# Altium schematic sheet dsau-motherboard-top.SchDoc: dSAU Motherboard - Top
size Letter; Engineer: Christopher J. Woodall; Organization: Boston University EDF/ECE; DocumentNumber: 1; Revision: A; SheetNumber: 1; SheetTotal: 10; EMAIL: cwoodall@bu.edu; TeamName: Team 19; ProjectName: dSAU
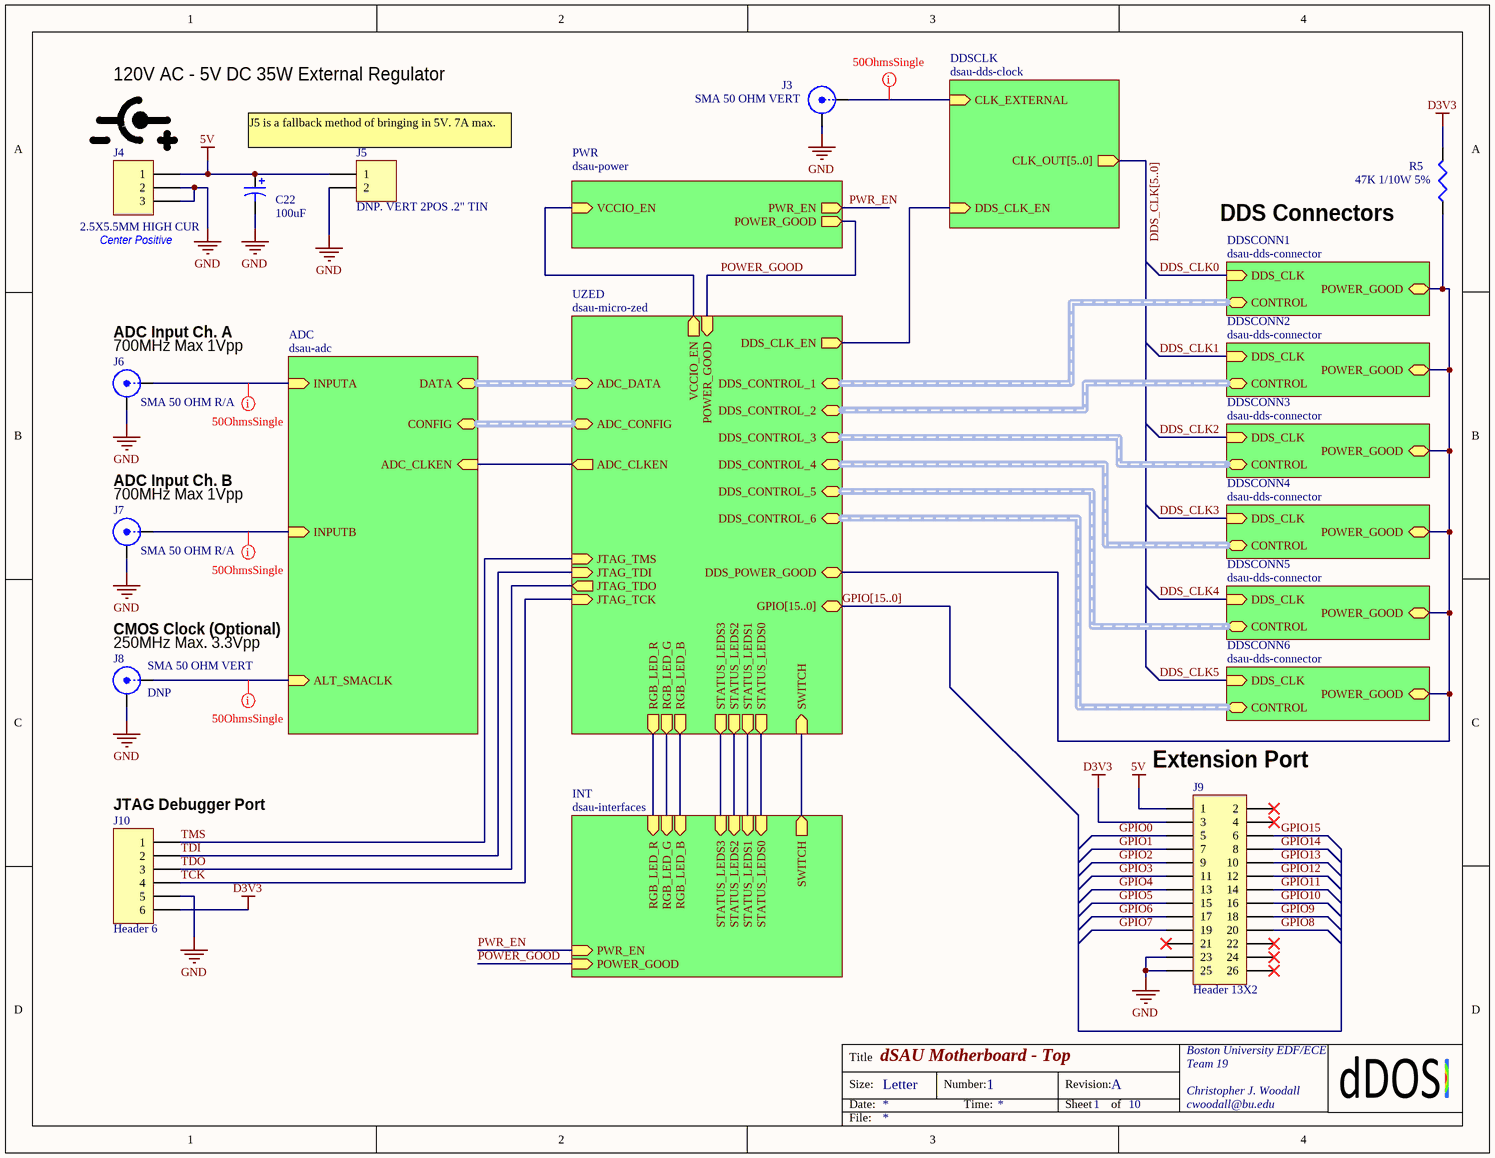
[diagram p0: dsau-motherboard-top.SchDoc]

## Parts
C22  value 100uF  [CAPPOL3216]  (hidden comment: TANT 100UF 10V 20%)
J3  SMA 50 OHM VERT  [MOLEX_SMBVERT_731000207]
J4  2.5X5.5MM HIGH CUR  [PJ-002BH]
J5  DNP. VERT 2POS .2" TIN  [MOLEX_2POS_200mil_0010085021]
J6  SMA 50 OHM R/A  [MOLEX_SMBRA_731000103]
J7  SMA 50 OHM R/A  [MOLEX_SMBRA_731000103]
J8  SMA 50 OHM VERT  value DNP  [MOLEX_SMBVERT_731000207]
J9  Header 13X2  [HDR2X13]
J10  Header 6  [HDR1X6]
R5  47K 1/10W 5%  [RESC1608L]

## Sub-sheets
ADC = dsau-adc: INPUTA (in), INPUTB (in), ALT_SMACLK (in), DATA (harness ADS62P49_LVDSDDR), ADC_CLKEN (in), CONFIG (harness ADS62P49_SPI_CONFIG)
DDSCLK = dsau-dds-clock: CLK_OUT[5..0] (out), DDS_CLK_EN (in), CLK_EXTERNAL (in)
DDSCONN1 = dsau-dds-connector: CONTROL (harness DDS_CONNECTOR), DDS_CLK (in), POWER_GOOD
DDSCONN2 = dsau-dds-connector: CONTROL (harness DDS_CONNECTOR), DDS_CLK (in), POWER_GOOD
DDSCONN3 = dsau-dds-connector: CONTROL (harness DDS_CONNECTOR), DDS_CLK (in), POWER_GOOD
DDSCONN4 = dsau-dds-connector: CONTROL (harness DDS_CONNECTOR), DDS_CLK (in), POWER_GOOD
DDSCONN5 = dsau-dds-connector: CONTROL (harness DDS_CONNECTOR), DDS_CLK (in), POWER_GOOD
DDSCONN6 = dsau-dds-connector: CONTROL (harness DDS_CONNECTOR), DDS_CLK (in), POWER_GOOD
INT = dsau-interfaces: STATUS_LEDS0 (in), STATUS_LEDS1 (in), STATUS_LEDS2 (in), STATUS_LEDS3 (in), RGB_LED_R (in), RGB_LED_G (in), RGB_LED_B (in), SWITCH (out), POWER_GOOD (in), PWR_EN (in)
PWR = dsau-power: VCCIO_EN (in), POWER_GOOD (out), PWR_EN (out)
UZED = dsau-micro-zed: ADC_DATA (harness ADS62P49_LVDSDDR), ADC_CONFIG (harness ADS62P49_SPI_CONFIG), ADC_CLKEN (out), DDS_CONTROL_1 (harness DDS_CONNECTOR), DDS_CONTROL_2 (harness DDS_CONNECTOR), DDS_CONTROL_3 (harness DDS_CONNECTOR), DDS_CONTROL_4 (harness DDS_CONNECTOR), DDS_CONTROL_5 (harness DDS_CONNECTOR), DDS_CONTROL_6 (harness DDS_CONNECTOR), JTAG_TCK (in), JTAG_TDI (in), JTAG_TDO (out), JTAG_TMS (in), STATUS_LEDS0 (out), STATUS_LEDS1 (out), STATUS_LEDS2 (out), STATUS_LEDS3 (out), RGB_LED_R (out), RGB_LED_G (out), RGB_LED_B (out), SWITCH (in), GPIO[15..0] (bidir), VCCIO_EN (out), POWER_GOOD (in), DDS_CLK_EN (out), DDS_POWER_GOOD

## Nets
5V: C22.1 J4.1 J5.1 J9.1
D3V3: J9.3 J10.6 R5.2
GND: C22.2 J3.2(Y) J4.2 J4.3 J5.2 J6.2(Y) J7.2(Y) J8.2(Y) J9.23 J9.25 J10.5
DDS_CLK0: sheet DDSCONN1/DDS_CLK
DDS_CLK1: sheet DDSCONN2/DDS_CLK
DDS_CLK2: sheet DDSCONN3/DDS_CLK
DDS_CLK3: sheet DDSCONN4/DDS_CLK
DDS_CLK4: sheet DDSCONN5/DDS_CLK
DDS_CLK5: sheet DDSCONN6/DDS_CLK
GPIO0: J9.5
GPIO1: J9.7
GPIO2: J9.9
GPIO3: J9.11
GPIO4: J9.13
GPIO5: J9.15
GPIO6: J9.17
GPIO7: J9.19
GPIO8: J9.20
GPIO9: J9.18
GPIO10: J9.16
GPIO11: J9.14
GPIO12: J9.12
GPIO13: J9.10
GPIO14: J9.8
GPIO15: J9.6
POWER_GOOD: sheet PWR/POWER_GOOD, sheet UZED/POWER_GOOD, sheet INT/POWER_GOOD
PWR_EN: sheet PWR/PWR_EN, sheet INT/PWR_EN
TCK: J10.4 ; sheet UZED/JTAG_TCK
TDI: J10.2 ; sheet UZED/JTAG_TDI
TDO: J10.3 ; sheet UZED/JTAG_TDO
TMS: J10.1 ; sheet UZED/JTAG_TMS
NetJ3_1: J3.1(X) ; sheet DDSCLK/CLK_EXTERNAL
NetJ6_1: J6.1(X) ; sheet ADC/INPUTA
NetJ7_1: J7.1(X) ; sheet ADC/INPUTB
NetJ8_1: J8.1(X) ; sheet ADC/ALT_SMACLK
NetR5_1: R5.1 ; sheet UZED/DDS_POWER_GOOD, sheet DDSCONN1/POWER_GOOD, sheet DDSCONN2/POWER_GOOD, sheet DDSCONN3/POWER_GOOD, sheet DDSCONN4/POWER_GOOD, sheet DDSCONN5/POWER_GOOD, sheet DDSCONN6/POWER_GOOD
(unnamed): sheet ADC/ADC_CLKEN, sheet UZED/ADC_CLKEN
(unnamed): sheet PWR/VCCIO_EN, sheet UZED/VCCIO_EN
(unnamed): sheet UZED/STATUS_LEDS0, sheet INT/STATUS_LEDS0
(unnamed): sheet UZED/STATUS_LEDS1, sheet INT/STATUS_LEDS1
(unnamed): sheet UZED/STATUS_LEDS2, sheet INT/STATUS_LEDS2
(unnamed): sheet UZED/STATUS_LEDS3, sheet INT/STATUS_LEDS3
(unnamed): sheet UZED/RGB_LED_R, sheet INT/RGB_LED_R
(unnamed): sheet UZED/RGB_LED_G, sheet INT/RGB_LED_G
(unnamed): sheet UZED/RGB_LED_B, sheet INT/RGB_LED_B
(unnamed): sheet UZED/SWITCH, sheet INT/SWITCH
(unnamed): sheet UZED/DDS_CLK_EN, sheet DDSCLK/DDS_CLK_EN

Not connected (* = marked no-connect by the designer): J9 2* 4* 21* 22* 24* 26*

## Buses and harness runs
bus DDS_CLK[5..0] = sheet DDSCLK/CLK_OUT[5..0]
bus GPIO[15..0] = sheet UZED/GPIO[15..0]
harness sheet ADC/CONFIG = sheet UZED/ADC_CONFIG
harness sheet ADC/DATA = sheet UZED/ADC_DATA
harness sheet DDSCONN1/CONTROL = sheet UZED/DDS_CONTROL_1
harness sheet DDSCONN2/CONTROL = sheet UZED/DDS_CONTROL_2
harness sheet DDSCONN3/CONTROL = sheet UZED/DDS_CONTROL_3
harness sheet DDSCONN4/CONTROL = sheet UZED/DDS_CONTROL_4
harness sheet DDSCONN5/CONTROL = sheet UZED/DDS_CONTROL_5
harness sheet DDSCONN6/CONTROL = sheet UZED/DDS_CONTROL_6

## Layout directives
net class 50OhmsSingle: NetJ3_1, NetJ6_1, NetJ7_1, NetJ8_1

## Notes on the sheet
- 120V AC - 5V DC 35W External Regulator
- J5 is a fallback method of bringing in 5V. 7A max.
- (near R5) DDS Connectors
- (near J4) Center Positive
- (near J6) ADC Input Ch. A
- (near J6) 700MHz Max 1Vpp
- (near J7) ADC Input Ch. B
- (near J7) 700MHz Max 1Vpp
- (near J8) CMOS Clock (Optional)
- (near J8) 250MHz Max. 3.3Vpp
- (near J9) Extension Port
- (near J10) JTAG Debugger Port
- Title
- Size:
- Date:
- Letter
- Number:
- Time:
- Revision:
- Sheet
- of
- File:

## Library data of the parts
C22 = Cap Pol3: Polarized Capacitor (Surface Mount); Manufacturer: Vishay Sprague; Manufacturer Part Number: TL8A0107M010C; Published: 8-Jun-2000; LatestRevisionDate: 29-May-2009; LatestRevisionNote: IPC-7351 Footprint Added.; PackageReference: C1206; Publisher: Altium Limited; PackageDescription: Chip Capacitor; Supplier 1: Digi-Key; Supplier Part Number 1: 718-1921-1-ND
J3 J8 = SMB: SMB Straight Connector; Manufacturer: Molex Inc; Manufacturer Part Number: 0733910060; LatestRevisionDate: 17-Jul-2002; LatestRevisionNote: Re-released for DXP Platform.; Publisher: Altium Limited; Supplier 1: Digi-Key; Supplier Part Number 1: WM5543-ND
J4 = Header 3: Header, 3-Pin; Manufacturer: CUI Inc; LatestRevisionDate: 17-Jul-2002; LatestRevisionNote: Re-released for DXP Platform.; Publisher: Altium Limited; Manufacturer Part Number: PJ-002BH; Supplier 1: Digi-Key; Supplier Part Number 1: CP-002BH-ND
J5 = Header 2: Header, 2-Pin; Manufacturer: Molex Inc; Manufacturer Part Number: 0010085021; LatestRevisionDate: 17-Jul-2002; LatestRevisionNote: Re-released for DXP Platform.; Publisher: Altium Limited; Supplier 1: Digi-Key; Supplier Part Number 1: WM4333-ND
J6 J7 = SMB: SMB Straight Connector; Manufacturer: Molex Inc; Manufacturer Part Number: 0733910320; LatestRevisionDate: 17-Jul-2002; LatestRevisionNote: Re-released for DXP Platform.; Publisher: Altium Limited; Supplier 1: Digi-Key; Supplier Part Number 1: WM8554-ND
J9 = Header 13X2: Header, 13-Pin, Dual row; LatestRevisionDate: 17-Jul-2002; LatestRevisionNote: Re-released for DXP Platform.; Publisher: Altium Limited; Supplier 1: Stock; Supplier Part Number 1: 2x13 pin 100mil Headers
J10 = Header 6: Header, 6-Pin; LatestRevisionDate: 17-Jul-2002; LatestRevisionNote: Re-released for DXP Platform.; Publisher: Altium Limited; Supplier 1: Stock; Supplier Part Number 1: 6 pin 100 mil
R5 = Res3: Resistor; Manufacturer: Yageo; Manufacturer Part Number: 311-47kGRCT-ND; Published: 8-Jun-2000; LatestRevisionDate: 29-May-2009; LatestRevisionNote: IPC-7351 Footprint Added.; PackageReference: J1-0603; Publisher: Altium Limited; PackageDescription: Chip Resistor; Supplier 1: Digi-Key; Supplier Part Number 1: 311-47KGRTR-ND; Value: 47K